# Altium schematic sheet JM24023-Y009-A-V1.0.schdoc
size 604 x 431 mm; Symbol: Sheet-Symbol_A4; Device: Sheet-Symbol_A4; Company: 嘉立创EDA; Version: V1.0; Page Size: A4; @Project Name: TEXT; @Page Count: 1; @Update Date: 2024-07-15; @Create Date: 2024-07-13; @Schematic Name: DS491-1376-SCH导的AD; @Page No: 1; @Page Name: DS491-1376-SCH导的AD
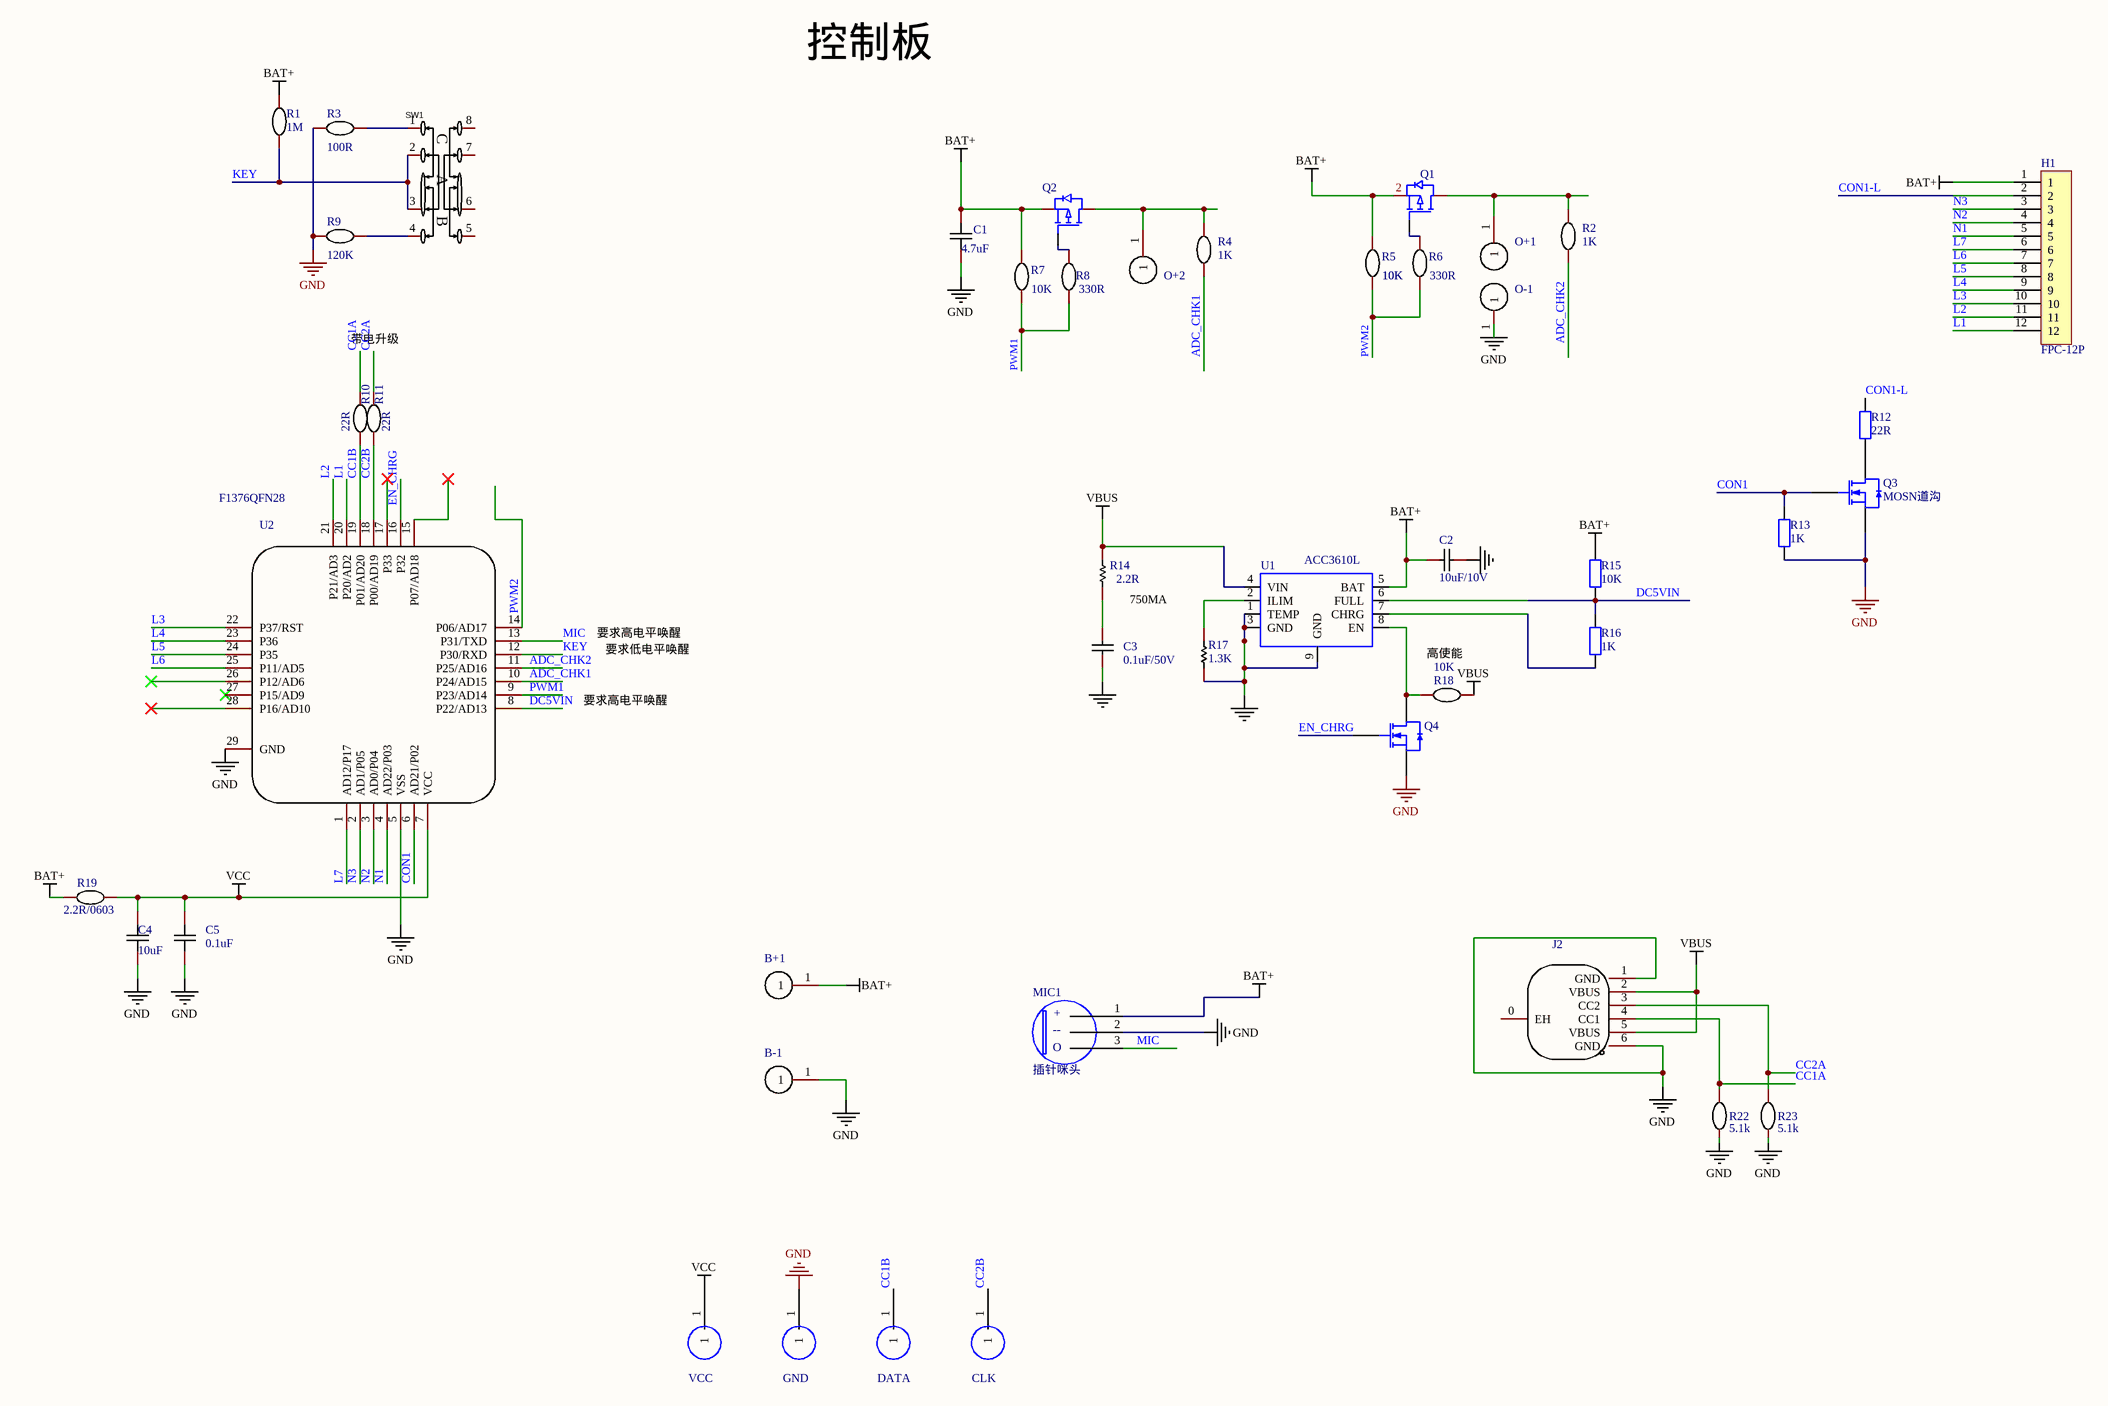
[diagram p0: JM24023-Y009-A-V1.0.schdoc]

## Parts
B+1  电池正  [TP1.5]  (value not drawn)
B-1  电池负  [TP1.5]  (value not drawn)
C1  Device: 4.7uF  [C0402S]  (hidden comment: 4.7uF10V)
C2  10uF/10V  [C0402S]
C3  0.1uF/50V  [C0402S]
C4  10uF  [C0402S]
C5  0.1uF  [C0402S]
CLK  PAD-烧入测试  [TP1.5]  (value not drawn)
DATA  PAD-烧入测试  [TP1.5]  (value not drawn)
GND  PAD-烧入测试  [TP1.5]  (value not drawn)
H1  FPC-12P  [CONN-SMD_12P-P0.50_L3.1-W8.0]
J2  TYPE-C 6P(073)-6.5MM  [USB_TYPEC_6L8 -2.0立贴]  (value not drawn)
MIC1  插针咪头  [三针咪/一芯微]
O+1  加热丝输出  [TP1.5]  (value not drawn)
O+2  加热丝输出  [TP1.5]  (value not drawn)
O-1  加热丝输出  [TP1.5]  (value not drawn)
Q1  P沟场效应管  [SOT-23-3_L2.9-W1.6-P1.90-LS2.8-BR]  (value not drawn)
Q2  P沟场效应管  [SOT-23-3_L2.9-W1.6-P1.90-LS2.8-BR]  (value not drawn)
Q3  MOSN道沟  [SOT-523-3_L1.7-W0.8-P1.00-LS1.5-BR]
Q4  (no value)  [SOT-523-3_L1.7-W0.8-P1.00-LS1.5-BR]
R1  1M  [R0402S]
R2  1K  [R0402S]
R3  100R  [R0402S]
R4  1K  [R0402S]
R5  10K  [R0402S]
R6  330R  [R0402S]
R7  10K  [R0402S]
R8  330R  [R0402S]
R9  120K  [R0402S]
R10  22R  [R0402S]
R11  22R  [R0402S]
R12  22R  [R0402S]
R13  1K  [R0402S]
R14  2.2R  [R0402S]
R15  10K  [R0402S]
R16  1K  [R0402S]
R17  1.3K  [R0402S]
R18  10k  [R0402S]
R19  2.2R/0603  [R0603S]
R22  5.1k  [R0402S]
R23  5.1k  [R0402S]
SW1  SW1  [SW-SMD_8P-L9.9-W3.5-P2.00]
U1  ACC3610L  [DFN-8-2X2-P0.50-TL-EP1.6]
U2  F1376QFN28  [QFN-28_L4.0-W4.0-P0.40-BL-EP2.6]
VCC  PAD-烧入测试  [TP1.5]  (value not drawn)

## Nets
BAT+: B+1.1 C1.2 C2.2 H1.1 MIC1.1(M+) Q1.2(S) Q2.2(S) R1.2 R5.2 R7.2 R15.2 R19.1 U1.5(BAT)
GND: B-1.1 C1.1 C2.1 C3.1 C4.2 C5.2 GND.1 J2.1(GND) J2.6(GND) MIC1.2(M-) O-1.1 Q3.2(S) Q4.2(S) R3.2 R9.2 R13.2 R17.2 R22.1 R23.1 U1.1(TEMP) U1.3(GND) U1.9(GND) U2.5(VSS) U2.29(GND)
VBUS: J2.2(VBUS) J2.5(VBUS) R14.2 R18.1 U1.4(VIN)
VCC: C4.1 C5.1 R19.2 U2.7(VCC) VCC.1
ADC_CHK1: R4.2 U2.10(P24/AD15)
ADC_CHK2: R2.2 U2.11(P25/AD16)
CC1A: J2.4(CC1) R10.1 R22.2
CC1B: DATA.1 R10.2 U2.19(P01/AD20)
CC2A: J2.3(CC2) R11.1 R23.2
CC2B: CLK.1 R11.2 U2.18(P00/AD19)
CON1: Q3.1(G) R13.1 U2.6(AD21/P02)
CON1-L: H1.2 R12.1
DC5VIN: R15.1 R16.2 U1.6(FULL) U2.8(P22/AD13)
EN_CHRG: Q4.1(G) U2.16(P32)
KEY: R1.1 SW1.2 SW1.3 U2.12(P30/RXD)
L1: H1.12 U2.20(P20/AD2)
L2: H1.11 U2.21(P21/AD3)
L3: H1.10 U2.22(P37/RST)
L4: H1.9 U2.23(P36)
L5: H1.8 U2.24(P35)
L6: H1.7 U2.25(P11/AD5)
L7: H1.6 U2.1(AD12/P17)
MIC: MIC1.3(OUT) U2.13(P31/TXD)
N1: H1.5 U2.4(AD22/P03)
N2: H1.4 U2.3(AD0/P04)
N3: H1.3 U2.2(AD1/P05)
PWM1: R7.1 R8.1 U2.9(P23/AD14)
PWM2: R5.1 R6.1 U2.14(P06/AD17)
NetC3_2: C3.2 R14.1
NetO+1_1: O+1.1 Q1.3(D) R2.1
NetO+2_1: O+2.1 Q2.3(D) R4.1
NetQ1_1: Q1.1(G) R6.2
NetQ2_1: Q2.1(G) R8.2
NetQ3_3: Q3.3(D) R12.2
NetQ4_3: Q4.3(D) R18.2 U1.8(EN)
NetR3_1: R3.1 SW1.1
NetR9_1: R9.1 SW1.4
NetR16_1: R16.1 U1.7(CHRG)
NetR17_1: R17.1 U1.2(ILIM)

Not connected (* = marked no-connect by the designer): J2 0(EH); SW1 5 6 7 8; U2 15(P07/AD18)* 17(P33)* 26(P12/AD6)* 27(P15/AD9)* 28(P16/AD10)*

## Notes on the sheet
- 控制板
- 带电升级
- 要求高电平唤醒
- 要求低电平唤醒
- 750MA
- 高使能
- 1
- 2
- 3
- 4
- 5
- 6
- A
- B
- C
- D
- 原理图
- DS491-1376-SCH导的AD
- 创建日期
- 更新日期
- 2024-07-15
- 2024-07-13
- 审阅
- 绘制
- 图页
- 物料编码
- TEXT
- 版本
- 尺寸
- 页
- 共
- V1.0
- A4
- 嘉立创EDA
- (in symbol 3Lin咪头) +; --; O
- (in symbol 8脚3档拨动开关) C; A; B

## Library data of the parts
B+1 = 电池正: Manufacturer: XFCN(兴飞); Manufacturer Part: PZ254V-11-01P; Symbol: 电池正极; Origin Footprint 2: HDR-TH_1P-P2.54-V-M; Add into BOM: yes; Name: 电池正; Device: 电池正; Supplier: LCSC; Supplier Part: C492400; JLCPCB Part Class: Extended Part; link: https://so.szlcsc.com/global.html?k=C492400&amp;amp;ref=editor; Convert to PCB: yes; Origin Footprint 1: 电池正极
B-1 = 电池负: Manufacturer: XFCN(兴飞); Manufacturer Part: PZ254V-11-01P; Symbol: 电池负极; Origin Footprint 2: HDR-TH_1P-P2.54-V-M; Add into BOM: yes; Name: 电池负; Device: 电池负; Supplier: LCSC; Supplier Part: C492400; JLCPCB Part Class: Extended Part; link: https://so.szlcsc.com/global.html?k=C492400&amp;amp;ref=editor; Convert to PCB: yes; Origin Footprint 1: 电池负极
C1 = 4.7uF10V: Origin Footprint 2: C0603; Add into BOM: yes; Name: 4.7uF10V; Symbol: 4.7uF; Convert to PCB: yes; Origin Footprint 1: 4.7uF
C2 = 10uF/10V: Add into BOM: yes; Origin Footprint: C0603; Name: 10uF/10V; Symbol: 10uF/10V; Device: 10uF/10V; Convert to PCB: yes; Design Item ID: CAP; Library Name: MyDesign; Origin Footprint 1: 10uF/10V
C3 = 0.1uF/50V: Add into BOM: yes; Origin Footprint: C0402; Name: 0.1uF/50V; Symbol: 0.1uF/50V; Device: 0.1uF/50V; Convert to PCB: yes; Design Item ID: CAP; Library Name: MyDesign; Origin Footprint 1: 0.1uF/50V
C4 = 10uF: Symbol: 4.7uF; Origin Footprint 2: C0603; Add into BOM: yes; Name: 10uF; Device: 10uF; Convert to PCB: yes; Origin Footprint 1: 4.7uF
C5 = 0.1uF: Origin Footprint 2: C0603; Add into BOM: yes; Name: 0.1uF; Symbol: 0.1uF; Device: 0.1uF; Convert to PCB: yes; Origin Footprint 1: 0.1uF
J2 = TYPE-C 6P(073)-6.5MM: Manufacturer: SHOU HAN(首韩); Origin Footprint 2: TYPE-C-SMD_TYPE-C-6P; Add into BOM: yes; Name: TYPE-C 6P(073)-6.5MM; Symbol: TYPE-C 6P(073); Device: TYPE-C 6P(073)-6.5MM; Supplier: LCSC; Supplier Part: C668623; Manufacturer Part: TYPE-C 6P(073); JLCPCB Part Class: Extended Part; link: https://so.szlcsc.com/global.html?k=C668623&amp;amp;ref=editor; Convert to PCB: yes; Origin Footprint 1: TYPE-C 6P(073)
MIC1 = 3Lin咪头: Parameter 1: 6*2.5; Parameter 2: DIP; VALUE: 插针咪头
O+1 O+2 O-1 = 加热丝输出: Manufacturer: XFCN(兴飞); Manufacturer Part: PZ254V-11-01P; Origin Footprint 2: HDR-TH_1P-P2.54-V-M; Add into BOM: yes; Name: 加热丝输出; Symbol: 加热丝输出; Device: 加热丝输出; Supplier: LCSC; Supplier Part: C492400; JLCPCB Part Class: Extended Part; link: https://so.szlcsc.com/global.html?k=C492400&amp;amp;ref=editor; Convert to PCB: yes; Origin Footprint 1: 加热丝输出
Q1 Q2 = PMOS: P-Channel Switch with Low RDS(on),SMD,VDS=-20V VGS=±12V ID-0.66A RDS(on)=7Ω; Parameter: SOT-523; Parameter 2: SMD
Q3 Q4 = MOSN道沟: MOS(场效应管); ComponentLink1Description: 供应商链接; ComponentLink1URL: http://www.szlcsc.com/product/details_21629.html; Package: SOT-23; Supplier: LC; SuppliersPartNumber: C20917
R1 R3 R9 = 47K: Origin Footprint 2: R0603; Add into BOM: yes; Symbol: 47K; Device: 47K; Convert to PCB: yes; Origin Footprint 1: 47K
  R1: Name: 1M
  R3: Name: 100R
  R9: Name: 120K
R2 R4 = 1K: Origin Footprint 2: R0603; Add into BOM: yes; Name: 1K; Symbol: 1K; Device: 1K; Convert to PCB: yes; Origin Footprint 1: 1K
R5 R7 = 10K: Origin Footprint 2: R0603; Add into BOM: yes; Name: 10K; Symbol: 10K; Device: 10K; Convert to PCB: yes; Origin Footprint 1: 10K
R6 R8 = 330R: Symbol: 10K; Origin Footprint 2: R0603; Add into BOM: yes; Name: 330R; Device: 330R; Convert to PCB: yes; Origin Footprint 1: 10K
R10 R11 = 22R: Symbol: 5.1K; Origin Footprint 2: R0603; Add into BOM: yes; Name: 22R; Device: 22R; Convert to PCB: yes; Origin Footprint 1: 5.1K
R12 R13 R15 R16 = RES 1%: 贴片电阻; ComponentLink1Description: 供应商链接; ComponentLink1URL: http://www.szlcsc.com/product/details_23704.html; Package: 0603; Supplier: LC; SuppliersPartNumber: C22977
R14 = 2R2/0402: Symbol: 2R2; Add into BOM: yes; Origin Footprint: R0402; Name: 2.2R; Device: 2R2/0402; Convert to PCB: yes; Design Item ID: RES1; Library Name: MyDesign; Origin Footprint 1: 2R2
R17 = 1.3K: Symbol: 2K; Add into BOM: yes; Origin Footprint: R0402; Name: 1.3K; Device: 1.3K; Convert to PCB: yes; Design Item ID: RES1; Library Name: MyDesign; Origin Footprint 1: 2K
R18 = RC0402FR-0710KL: 电阻类型:厚膜电阻;阻值:10kΩ;精度:±1%;功率:62.5mW;最大工作电压:50V;温度系数:±100ppm/℃;; Manufacturer: YAGEO(国巨); Add into BOM: yes; Value: 10kΩ; Tolerance: ±1%; Power(Watts): 62.5mW; Overload Voltage (Max): 50V; Origin Footprint 2: R0603; Name: 10k; Symbol: 10K; Device: RC0402FR-0710KL; LCSC Part Name: 厚膜电阻 10kΩ ±1% 62.5mW; Supplier Part: C60490; Manufacturer Part: RC0402FR-0710KL; Supplier Footprint: 0402; JLCPCB Part Class: Extended Part; Datasheet: https://atta.szlcsc.com/upload/public/pdf/source/20170925/C131467_1506321478108990263.pdf; Supplier: LCSC; Convert to PCB: yes; Type: 厚膜电阻; Temperature Coefficient: ±100ppm/℃; Operating Temperature Range: -55℃~+155℃; Origin Footprint 1: 10K
R19 = 2.2R/0805: Symbol: 2.2R; Origin Footprint 2: R0603; Add into BOM: yes; Name: 2.2R/0805; Device: 2.2R/0805; Convert to PCB: yes; Origin Footprint 1: 2.2R
R22 R23 = 5.1k: Origin Footprint 2: R0603; Add into BOM: yes; Name: 5.1k; Symbol: 5.1K; Device: 5.1k; Convert to PCB: yes; Origin Footprint 1: 5.1K
SW1 = 8脚3档拨动开关: Manufacturer: Yuandi(元迪); Symbol: TA-3537S-A1; Add into BOM: yes; Device: TA-3537S-A1; LCSC Part Name: 滑动开关9.9*3.5*1.0mm贴片正拨八脚三档; Supplier Part: C514052; Manufacturer Part: TA-3537S-A1; Supplier Footprint: SMD,3.5x9.9mm; JLCPCB Part Class: Extended Part; Datasheet: https://atta.szlcsc.com/upload/public/pdf/source/20200415/C514053_11B997AE7F75B180DEFB873A3E85EB37.pdf; Supplier: LCSC; Convert to PCB: yes; Comment_1: TA-3537S-A1
U1 = SA4356: 36V 集成 OVP 保护 1.0A 锂电池线性充电芯片; Parameter 1: DFN3*3-8L; Parameter 2: SMD; VALUE: SA4356
U2 = F1376QFN28: Add into BOM: yes; Name: F1376QFN28; Symbol: F1376QFN28; Device: F1376QFN28; Convert to PCB: yes; Origin Footprint 1: F1376QFN28